# EAGLE design mother_board_v2.0 (EAGLE 7.5.0)
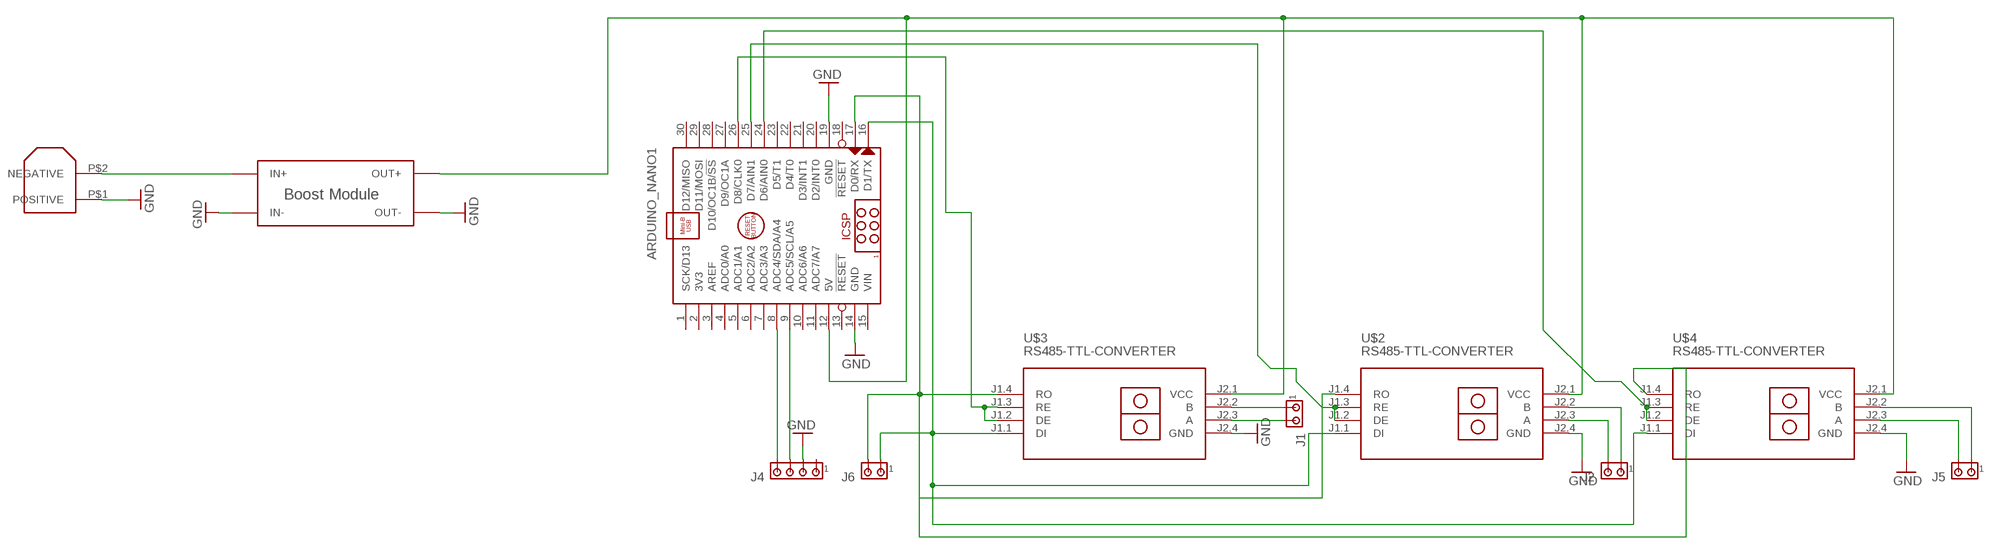
[diagram p0: schematic, sheet 1]

## Parts
ARDUINO_NANO1  ARDUINO_NANO  [ARDUINO_NANO]
J1  MTA02-100  [10X02MTA]
J2  MTA02-100  [10X02MTA]
J4  MTA04-100  [10X04MTA]
J5  MTA02-100  [10X02MTA]
J6  MTA02-100  [10X02MTA]
U$2  RS485-TTL-CONVERTER  [RS485-TTL-CONVERTER]
U$3  RS485-TTL-CONVERTER  [RS485-TTL-CONVERTER]
U$4  RS485-TTL-CONVERTER  [RS485-TTL-CONVERTER]
U$5  BOOST_MODULE  [BOOST_MODULE]
U$6  XT60  [CONNECTOR]

## Nets
GND: ARDUINO_NANO1.14(GND) ARDUINO_NANO1.19(GND) J4.2 U$2.J2.4(GND) U$3.J2.4(GND) U$4.J2.4(GND) U$5.IN- U$5.OUT- U$6.P$1(POSITIVE)
N$1: J5.2 U$4.J2.3(A)
N$2: J5.1 U$4.J2.2(B)
N$3: J2.2 U$2.J2.3(A)
N$4: J1.2 U$3.J2.3(A)
N$5: J1.1 U$3.J2.2(B)
N$6: ARDUINO_NANO1.26(D8/CLK0) U$3.J1.2(DE) U$3.J1.3(RE)
N$7: ARDUINO_NANO1.12(5V) U$2.J2.1(VCC) U$3.J2.1(VCC) U$4.J2.1(VCC) U$5.OUT+
N$8: U$5.IN+ U$6.P$2(NEGATIVE)
N$9: J2.1 U$2.J2.2(B)
N$10: ARDUINO_NANO1.25(D7/AIN1) U$2.J1.2(DE) U$2.J1.3(RE)
N$12: ARDUINO_NANO1.9(ADC5/SCL/A5) J4.3
N$14: ARDUINO_NANO1.17(D0/RX) J6.2 U$2.J1.4(RO) U$3.J1.4(RO) U$4.J1.4(RO)
N$19: ARDUINO_NANO1.8(ADC4/SDA/A4) J4.4
N$21: ARDUINO_NANO1.24(D6/AIN0) U$4.J1.2(DE) U$4.J1.3(RE)
N$22: ARDUINO_NANO1.16(D1/TX) J6.1 U$2.J1.1(DI) U$3.J1.1(DI) U$4.J1.1(DI)
Unconnected: ARDUINO_NANO1.1(SCK/D13) ARDUINO_NANO1.2(3V3) ARDUINO_NANO1.3(AREF) ARDUINO_NANO1.4(ADC0/A0) ARDUINO_NANO1.5(ADC1/A1) ARDUINO_NANO1.6(ADC2/A2) ARDUINO_NANO1.7(ADC3/A3) ARDUINO_NANO1.10(ADC6/A6) ARDUINO_NANO1.11(ADC7/A7) ARDUINO_NANO1.13(!RESET) ARDUINO_NANO1.18(!RESET) ARDUINO_NANO1.20(D2/INT0) ARDUINO_NANO1.21(D3/INT1) ARDUINO_NANO1.22(D4/T0) ARDUINO_NANO1.23(D5/T1) ARDUINO_NANO1.27(D9/OC1A) ARDUINO_NANO1.28(D10/OC1B/!SS) ARDUINO_NANO1.29(D11/MOSI) ARDUINO_NANO1.30(D12/MISO) J4.1

## Power pins joined to a net without a drawn wire
VIN: ARDUINO_NANO1.15(VIN)

## Library data of the parts
ARDUINO_NANO1 = ArduinoNanoV30:ARDUINO_NANO: Arduino Nano V3.0 Module Overview: The Arduino Nano is a small, complete, and breadboard-friendly board based on the ATmega328 (Arduino Nano 3.x) or ATmega168 (Arduino Nano 2.x). It has more or less the same functionality of the Arduino Duemilanove, but in a different package. It lacks only a DC power jack, and works with a Mini-B USB cable instead of a standard one. The Nano was designed and is being produced by Gravitech <http://www.gravitech.us/arna30wiatp.html>. General specifications: Item Value Microcontroller Atmel ATmega168 or ATmega328 Operating Voltage (logic level) 5 V Input Voltage (recommended) 7-12 V Input Voltage (limits) 6-20 V Digital I/O Pins 14 (of which 6 provide PWM output) Analog Input Pins 8 DC Current per I/O Pin 40 mA Flash Memory 16 KB (ATmega168) or 32 KB (ATmega328) of which 2 KB used by bootloader SRAM 1 KB (ATmega168) or 2 KB (ATmega328) EEPROM 512 bytes (ATmega168) or 1 KB (ATmega328) Clock Speed 16 MHz Dimensions (Inches) 0.73" x 1.70" Dimensions (mm) 18mm x 45mm Overall height About 9 mm (not including pins) Weigth 5 g Power: The Arduino Nano can be powered via the Mini-B USB connection, 6-20V unregulated external power supply (pin 30), or 5V regulated external power supply (pin 27). The power source is automatically selected to the highest voltage source. Memory: The ATmega168 has 16 KB of flash memory for storing code (of which 2 KB is used for the bootloader); the ATmega328 has 32 KB, (also with 2 KB used for the bootloader). The ATmega168 has 1 KB of SRAM and 512 bytes of EEPROM (which can be read and written with the EEPROM library); the ATmega328 has 2 KB of SRAM and 1 KB of EEPROM. Input and Output: Each of the 14 digital pins on the Nano can be used as an input or output, using pinMode(), digitalWrite(), and digitalRead() functions. They operate at 5 volts. Each pin can provide or receive a maximum of 40 mA and has an internal pull-up resistor (disconnected by default) of 20-50 kOhms. In addition, some pins have specialized functions. Visit Arduino - ArduinoBoardNano <https://www.arduino.cc/en/Main/ArduinoBoardNano>
J1 J2 J5 J6 = con-amp:MTA02-100: AMP connector
J4 = con-amp:MTA04-100: AMP connector
U$2-U$4 = diy-modules:RS485-TTL-CONVERTER: RS485 to TTL converter based on MAX485 chip
U$5 = Boost Module:BOOST_MODULE
U$6 = xt60_V2:XT60

## Board
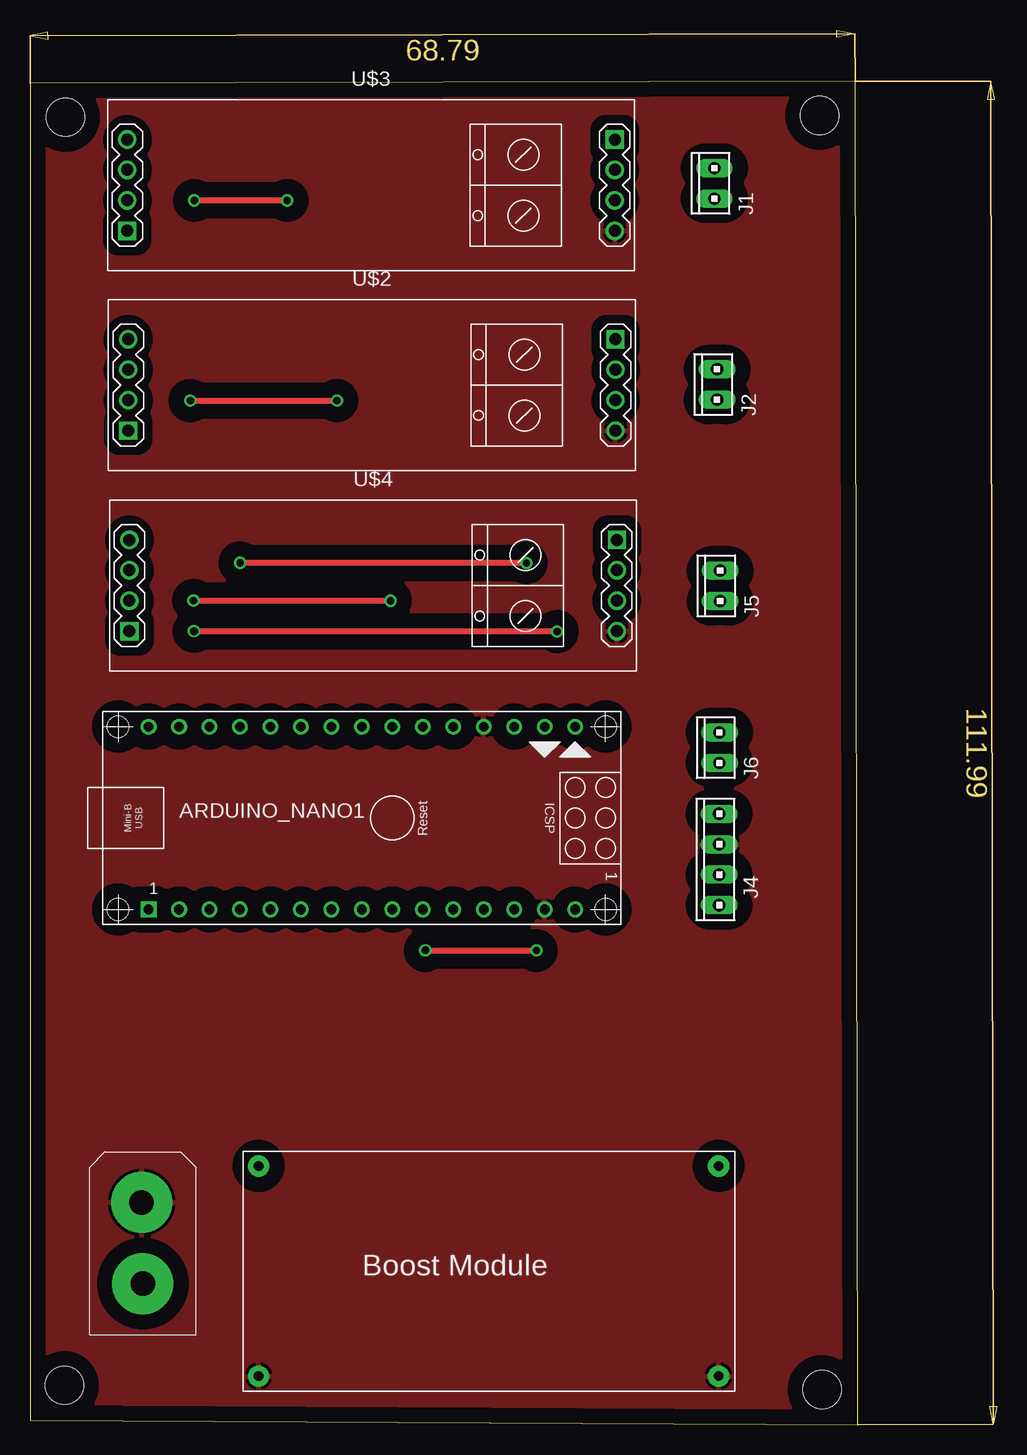
[diagram p1: board, top side]
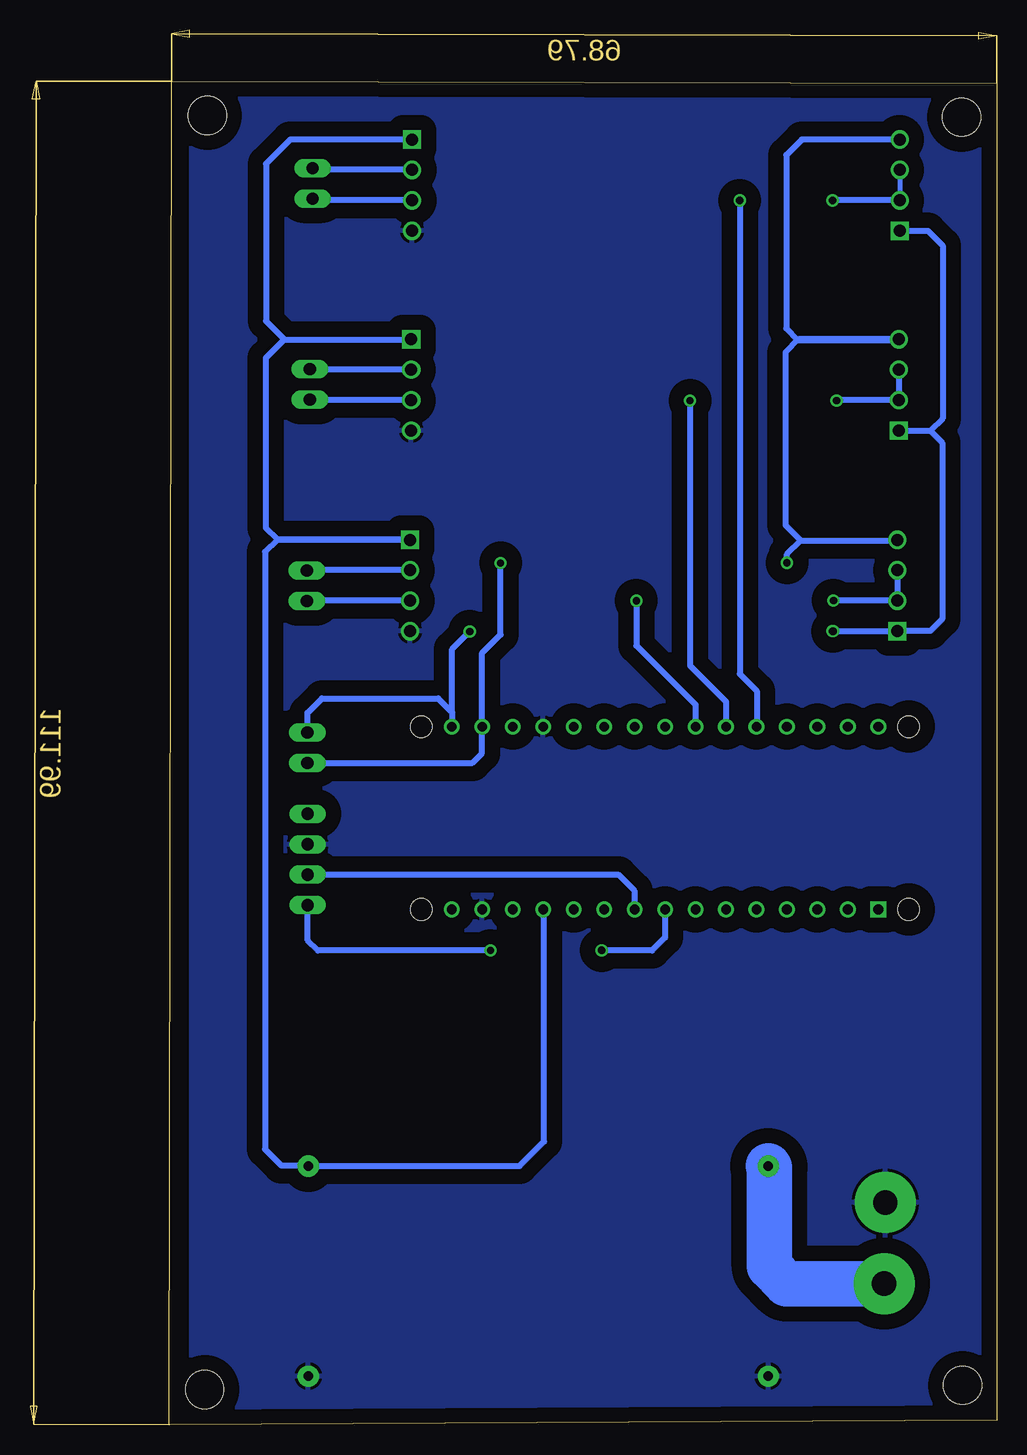
[diagram p2: board, bottom side, seen from below]

Size 68.99 x 111.99 mm. Coordinates in mm from the lower left corner, seen from the top.
Outline: 0,0.38 68.99,0 68.79,111.99 0,111.81 0,0.38
Copper layers (1*16): Top 0.035mm / dielectric 1.5mm / Bottom 0.035mm
Design rules "default": minimum track width 10mil, minimum drill 24mil, track to track 8mil, track to pad 8mil, pad to pad 8mil, via to via 8mil, smd to smd 8mil, copper to edge 40mil, drill to drill 8mil, minimum pad ring 10mil, minimum via ring 8mil, stop-mask expansion 4mil, vias tented up to drill 0mil, thermal gap 10mil
Holes 3.17 mm at 2.87,3.28 66.04,2.92 2.95,108.99 65.81,109.14

### Footprints (pad centres in the part's own frame; a part is rotated, then mirrored left to right if it is on the bottom)
ARDUINO_NANO = drill 0.8 square: 1 -20.32,-7.62 | drill 0.8: 2 -17.78,-7.62; 3 -15.24,-7.62; 4 -12.7,-7.62; 5 -10.16,-7.62; 6 -7.62,-7.62; 7 -5.08,-7.62; 8 -2.54,-7.62; 9 0,-7.62; 10 2.54,-7.62; 11 5.08,-7.62; 12 7.62,-7.62; 13 10.16,-7.62; 14 12.7,-7.62; 15 15.24,-7.62; 16 15.24,7.62; 17 12.7,7.62; 18 10.16,7.62; 19 7.62,7.62; 20 5.08,7.62; 21 2.54,7.62; 22 0,7.62; 23 -2.54,7.62; 24 -5.08,7.62; 25 -7.62,7.62; 26 -10.16,7.62; 27 -12.7,7.62; 28 -15.24,7.62; 29 -17.78,7.62; 30 -20.32,7.62 | hole 1.778: -22.86,-7.62; -22.86,7.62; 17.78,7.62; 17.78,-7.62
10X02MTA = drill 1.016 long: 1 1.27,0; 2 -1.27,0
10X04MTA = drill 1.016 long: 1 3.81,0; 2 1.27,0; 3 -1.27,0; 4 -3.81,0
RS485-TTL-CONVERTER = drill 1 square: J1.1 -20.32,-3.81; J2.1 20.32,3.81 | drill 1: J1.2 -20.32,-1.27; J1.3 -20.32,1.27; J1.4 -20.32,3.81; J2.2 20.32,1.27; J2.3 20.32,-1.27; J2.4 20.32,-3.81
BOOST_MODULE = drill 0.8 pad 1.778: IN+ 1.27,18.796; IN- 1.27,1.27; OUT+ 39.624,18.796; OUT- 39.624,1.27
CONNECTOR = drill 2.032 pad 5.08: P$1 4.343,12.294; P$2 4.445,5.537

### Placement (x,y rotation side)
ARDUINO_NANO1  30.2,50.57 0 top
J1  57.05,103.48 90 top
J2  57.28,86.72 90 top
J4  57.45,47.12 90 top
J5  57.53,69.93 90 top
J6  57.48,56.44 90 top
U$2  28.5,86.66 0 top
U$3  28.42,103.33 0 top
U$4  28.6,69.95 0 top
U$5  17.78,2.77 0 top
U$6  4.95,6.22 0 top

### Tracks (layer width: path | path; a pad name or v marks a point on that pad's centre or on a via)
GND
  pour Bottom (isolate 1.27): 0,112.14 67.18,111.86 67.18,0.1 0,0.38
  pour Top (isolate 1.27): -1.37,113.77 69.88,112.95 69.88,-2.24 -1.37,-1.42
N$1
  Bottom 0.508: U$4.J2.3 57.51,68.68 J5.2
N$2
  Bottom 0.508: U$4.J2.2 57.51,71.22 J5.1
N$3
  Bottom 0.508: J2.2 48.87,85.45 U$2.J2.3
N$4
  Bottom 0.508: U$3.J2.3 56.9,102.06 J1.2
N$5
  Bottom 0.508: U$3.J2.2 56.9,104.6 J1.1
N$6  (via drill 0.6)
  Top 0.508: v13.69,102.06 v21.44,102.06
  Bottom 0.406: U$3.J1.3 U$3.J1.2
  Bottom 0.508: U$3.J1.2 v13.69,102.06 13.72,102.06 | v21.44,102.06 21.44,62.59 20.02,61.16 20.02,58.22 ARDUINO_NANO1.26
N$7
  Bottom 0.508: ARDUINO_NANO1.12 37.74,42.88 37.74,23.6 39.78,21.57 U$5.OUT+ 57.45,21.62 59.66,21.62 61.01,22.96 61.01,72.77 60.02,73.76 U$4.J2.1 48.97,73.81 60.02,73.81 60.96,74.75 60.96,88.92 59.44,90.45 59.38,90.45 | U$3.J2.1 58.9,107.14 60.94,105.11 60.94,92 59.38,90.45 | 59.38,90.45 48.84,90.45 U$2.J2.1
N$8
  Bottom 3.81: U$6.P$2 17.53,11.76 18.95,13.18 18.95,21.46 U$5.IN+
N$9
  Bottom 0.508: U$2.J2.2 57.23,87.94 J2.1
N$10  (via drill 0.6)
  Top 0.508: v13.36,85.37 v25.58,85.37
  Bottom 0.508: U$2.J1.3 U$2.J1.2 13.34,85.4 v13.36,85.37 | v25.58,85.37 25.58,63.27 22.58,60.27 ARDUINO_NANO1.25
N$11  (via drill 0.6)
  other vias: 32.97,39.55
N$12
  Bottom 0.508: J4.3 31.55,45.85 30.23,44.53 30.23,42.98 ARDUINO_NANO1.9
N$13  (via drill 0.6)
  other vias: 13.34,85.37
N$14  (via drill 0.6)
  Top 0.508: v41.38,71.83 v17.5,71.83
  Bottom 0.508: J6.2 43.71,55.17 42.93,55.96 42.93,58.17 ARDUINO_NANO1.17 42.9,64.34 41.38,65.86 v41.38,71.83 | U$3.J1.4 16.26,107.14 17.55,105.84 17.55,91.39 16.59,90.42 8.23,90.42 U$2.J1.4 16.54,90.48 17.63,89.38 17.63,74.98 16.36,73.71 | 16.36,73.71 8.33,73.71 U$4.J1.4 | v17.5,71.83 17.5,72.57 16.36,73.71
N$15  (via drill 0.6)
  other vias: 13.61,68.71
N$16  (via drill 0.6)
  other vias: 30.05,68.68
N$17  (via drill 0.6)
  other vias: 13.64,66.14
N$18  (via drill 0.6)
  other vias: 17.5,71.86
N$19  (via drill 0.6)
  Top 0.508: v32.94,39.52 v42.22,39.52
  Bottom 0.508: ARDUINO_NANO1.8 27.66,40.61 28.75,39.52 v32.94,39.52 | v42.22,39.52 56.59,39.52 57.45,40.39 J4.4
N$21  (via drill 0.6)
  Top 0.508: v13.64,68.71 v30.05,68.71
  Bottom 0.508: U$4.J1.3 U$4.J1.2 13.61,68.68 v13.64,68.71 | v30.05,68.71 30.05,64.95 25.12,60.02 ARDUINO_NANO1.24
N$22  (via drill 0.6)
  Top 0.508: v43.94,66.12 13.72,66.12 v13.69,66.14
  Bottom 0.508: J6.1 57.48,59.33 56.26,60.55 46.58,60.55 45.41,59.38 | 45.41,59.38 45.41,58.22 ARDUINO_NANO1.16 | U$3.J1.1 5.74,99.52 4.52,98.3 4.52,83.87 5.54,82.86 | U$2.J1.1 5.54,82.86 | 5.54,82.86 4.55,81.86 4.55,67.16 5.54,66.17 8.26,66.17 U$4.J1.1 v13.69,66.14 | 45.41,59.38 45.41,64.64 v43.94,66.12